# Altium schematic sheet sensor.SchDoc
size A4
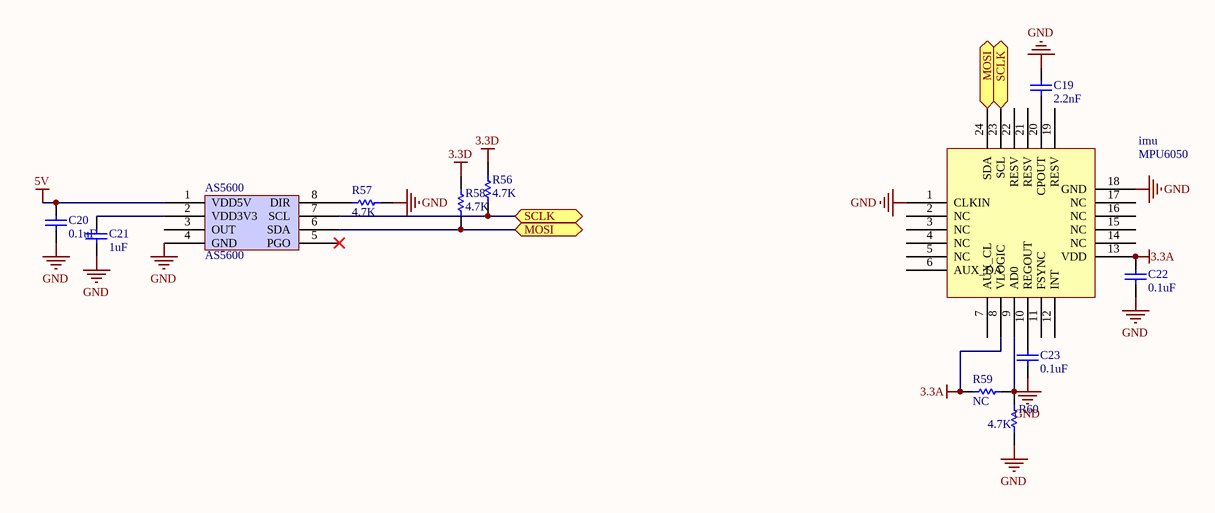
[diagram p0: sensor.SchDoc]

## Parts
AS5600  AS5600  [SOIC8_39MM]
C19  2.2nF  [0603]
C20  0.1uF  [0603]
C21  1uF  [0603]
C22  0.1uF  [0603]
C23  0.1uF  [0603]
imu  MPU6050  [MPU6050-2]
R56  4.7K  [0603]
R57  4.7K  [0603]
R58  4.7K  [0603]
R59  NC  [0603]
R60  4.7K  [0603]

## Ports
MOSI, SCLK

## Nets
3.3A: C22.2 imu.8(VLOGIC) imu.13(VDD) R59.1
3.3D: R56.2 R58.2
5V: AS5600.1(VDD5V) C20.1
GND: AS5600.4(GND) C19.2 C20.2 C21.1 C22.1 C23.1 imu.1(CLKIN) imu.18(GND) R57.2 R60.2
MOSI: AS5600.6(SDA) imu.24(SDA) R58.1 ; port MOSI
SCLK: AS5600.7(SCL) imu.23(SCL) R56.1 ; port SCLK
NetAS5600_2: AS5600.2(VDD3V3) C21.2
NetAS5600_8: AS5600.8(DIR) R57.1
NetC19_1: C19.1 imu.20(CPOUT)
NetC23_2: C23.2 imu.10(REGOUT)
Netimu_9: imu.9(AD0) R59.2 R60.1

Not connected (* = marked no-connect by the designer): AS5600 3(OUT) 5(PGO)*; imu 2(NC) 3(NC) 4(NC) 5(NC) 6(AUX_DA) 7(AUX_CL) 11(FSYNC) 12(INT) 14(NC) 15(NC) 16(NC) 17(NC) 19(RESV) 21(RESV) 22(RESV)

## Library data of the parts
C19 C21 = Cap: Capacitor; Value: 0.1uf; Published: 8-Jun-2000; LatestRevisionDate: 17-Jul-2002; LatestRevisionNote: Re-released for DXP Platform.; PackageReference: RAD-0.3; Publisher: Altium Limited; PackageDescription: Radial Cap, Thru-Hole; 2 Leads; 0.3 in Pin Spacing
C20 C22 C23 = Cap: Capacitor; Published: 8-Jun-2000; LatestRevisionDate: 17-Jul-2002; LatestRevisionNote: Re-released for DXP Platform.; PackageReference: RAD-0.3; Publisher: Altium Limited; PackageDescription: Radial Cap, Thru-Hole; 2 Leads; 0.3 in Pin Spacing; Value: 0.1uf
R56-R60 = Res1: Resistor; Value: 10K; Published: 8-Jun-2000; LatestRevisionDate: 17-Jul-2002; LatestRevisionNote: Re-released for DXP Platform.; PackageReference: AXIAL-0.3; Publisher: Altium Limited; PackageDescription: Axial Device, Thru-Hole; 2 Leads; 0.3 in Pin Spacing